# EasyEDA schematic SCH_明信卡片_2022-03-10.json
TITLE: Sheet_1; REV: 1.0; Date: 2022-01-03; Sheet: 1/1; Drawn By: DarkFox; Company: Your Company
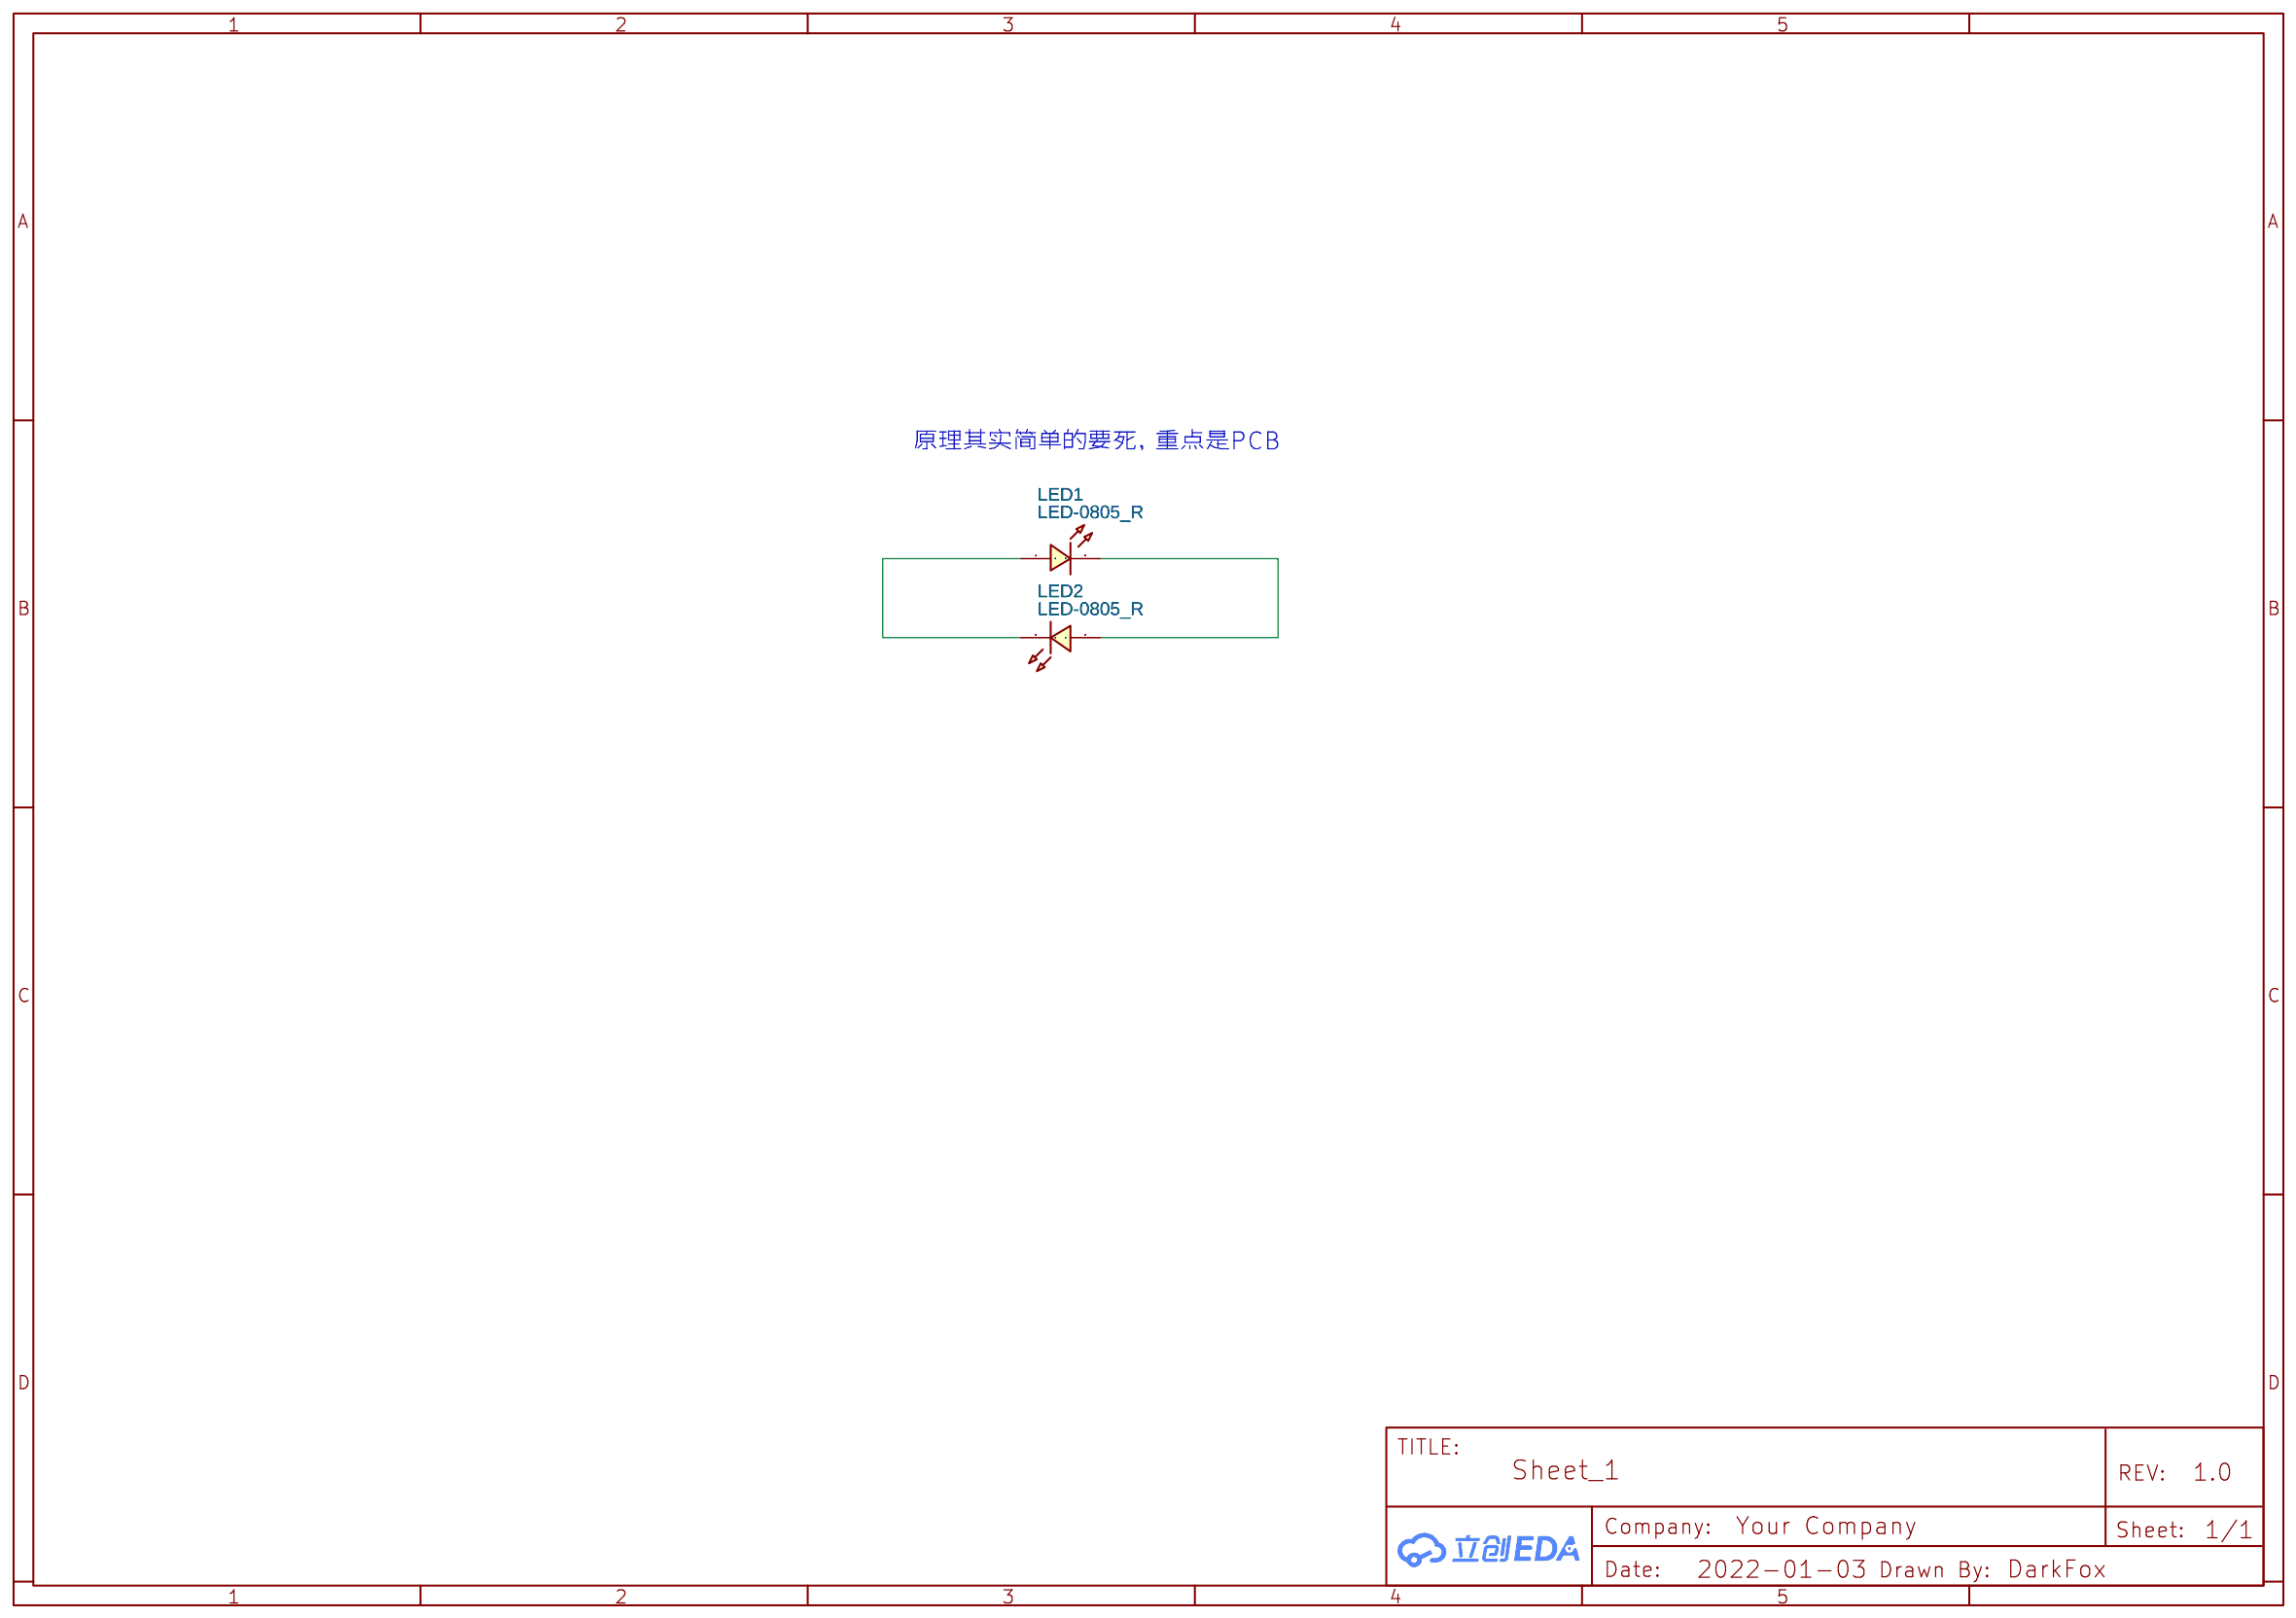
[diagram p0: schematic sheet]

## Parts
LED1  LED-0805_R  [LED0805_RED]
LED2  LED-0805_R  [LED0805_RED]

## Library data of the parts
LED1 LED2 = LED-0805_R: Manufacturer: EVERLIGHT(台湾亿光); Manufacturer Part: 17-21SURC/S530-A3/TR8; Supplier Part: C72037; Contributor: LCEDA_Lib

## Nets
Net-(LED1-1): LED1.1 LED2.2
Net-(LED1-2): LED1.2 LED2.1

## Notes on the sheet
- 原理其实简单的要死，重点是PCB
